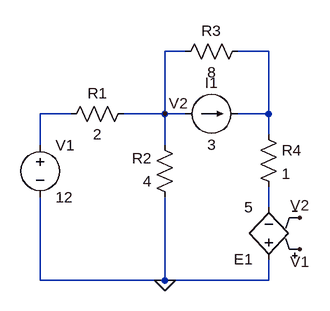
[diagram p0: schematic Draft28.asc]
Draft28.asc, the LTspice schematic file:
Version 4
SHEET 1 880 680
WIRE 256 -16 224 -16
WIRE 384 -16 336 -16
WIRE 80 80 32 80
WIRE 224 80 224 -16
WIRE 224 80 160 80
WIRE 256 80 224 80
WIRE 384 80 384 -16
WIRE 384 80 336 80
WIRE 384 112 384 80
WIRE 32 128 32 80
WIRE 224 128 224 80
WIRE 384 224 384 192
WIRE 32 336 32 208
WIRE 224 336 224 208
WIRE 224 336 32 336
WIRE 384 336 384 304
WIRE 384 336 224 336
FLAG 224 80 V2
FLAG 432 240 V2
FLAG 432 288 V1
FLAG 224 336 0
SYMBOL voltage 32 112 R0
SYMATTR InstName V1
SYMATTR Value 12
SYMBOL res 176 64 R90
WINDOW 0 0 56 VBottom 2
WINDOW 3 32 56 VTop 2
SYMATTR InstName R1
SYMATTR Value 2
SYMBOL res 240 224 R180
WINDOW 0 36 76 Left 2
WINDOW 3 36 40 Left 2
SYMATTR InstName R2
SYMATTR Value 4
SYMBOL res 240 0 R270
WINDOW 0 32 56 VTop 2
WINDOW 3 0 56 VBottom 2
SYMATTR InstName R3
SYMATTR Value 8
SYMBOL current 256 80 R270
WINDOW 0 32 40 VTop 2
WINDOW 3 -32 40 VBottom 2
SYMATTR InstName I1
SYMATTR Value 3
SYMBOL res 368 96 R0
SYMATTR InstName R4
SYMATTR Value 1
SYMBOL e 384 320 R180
SYMATTR InstName E1
SYMATTR Value 5

The netlist it stands for:
* Draft28.asc
V1 N002 0 12
R1 V2 N002 2
R2 0 V2 4
R3 V2 N001 8
I1 V2 N001 3
R4 N001 N003 1
E1 0 N003 V1 V2 5
.backanno
.end